# Altium schematic sheet Rev_C_Power.SchDoc
size A3
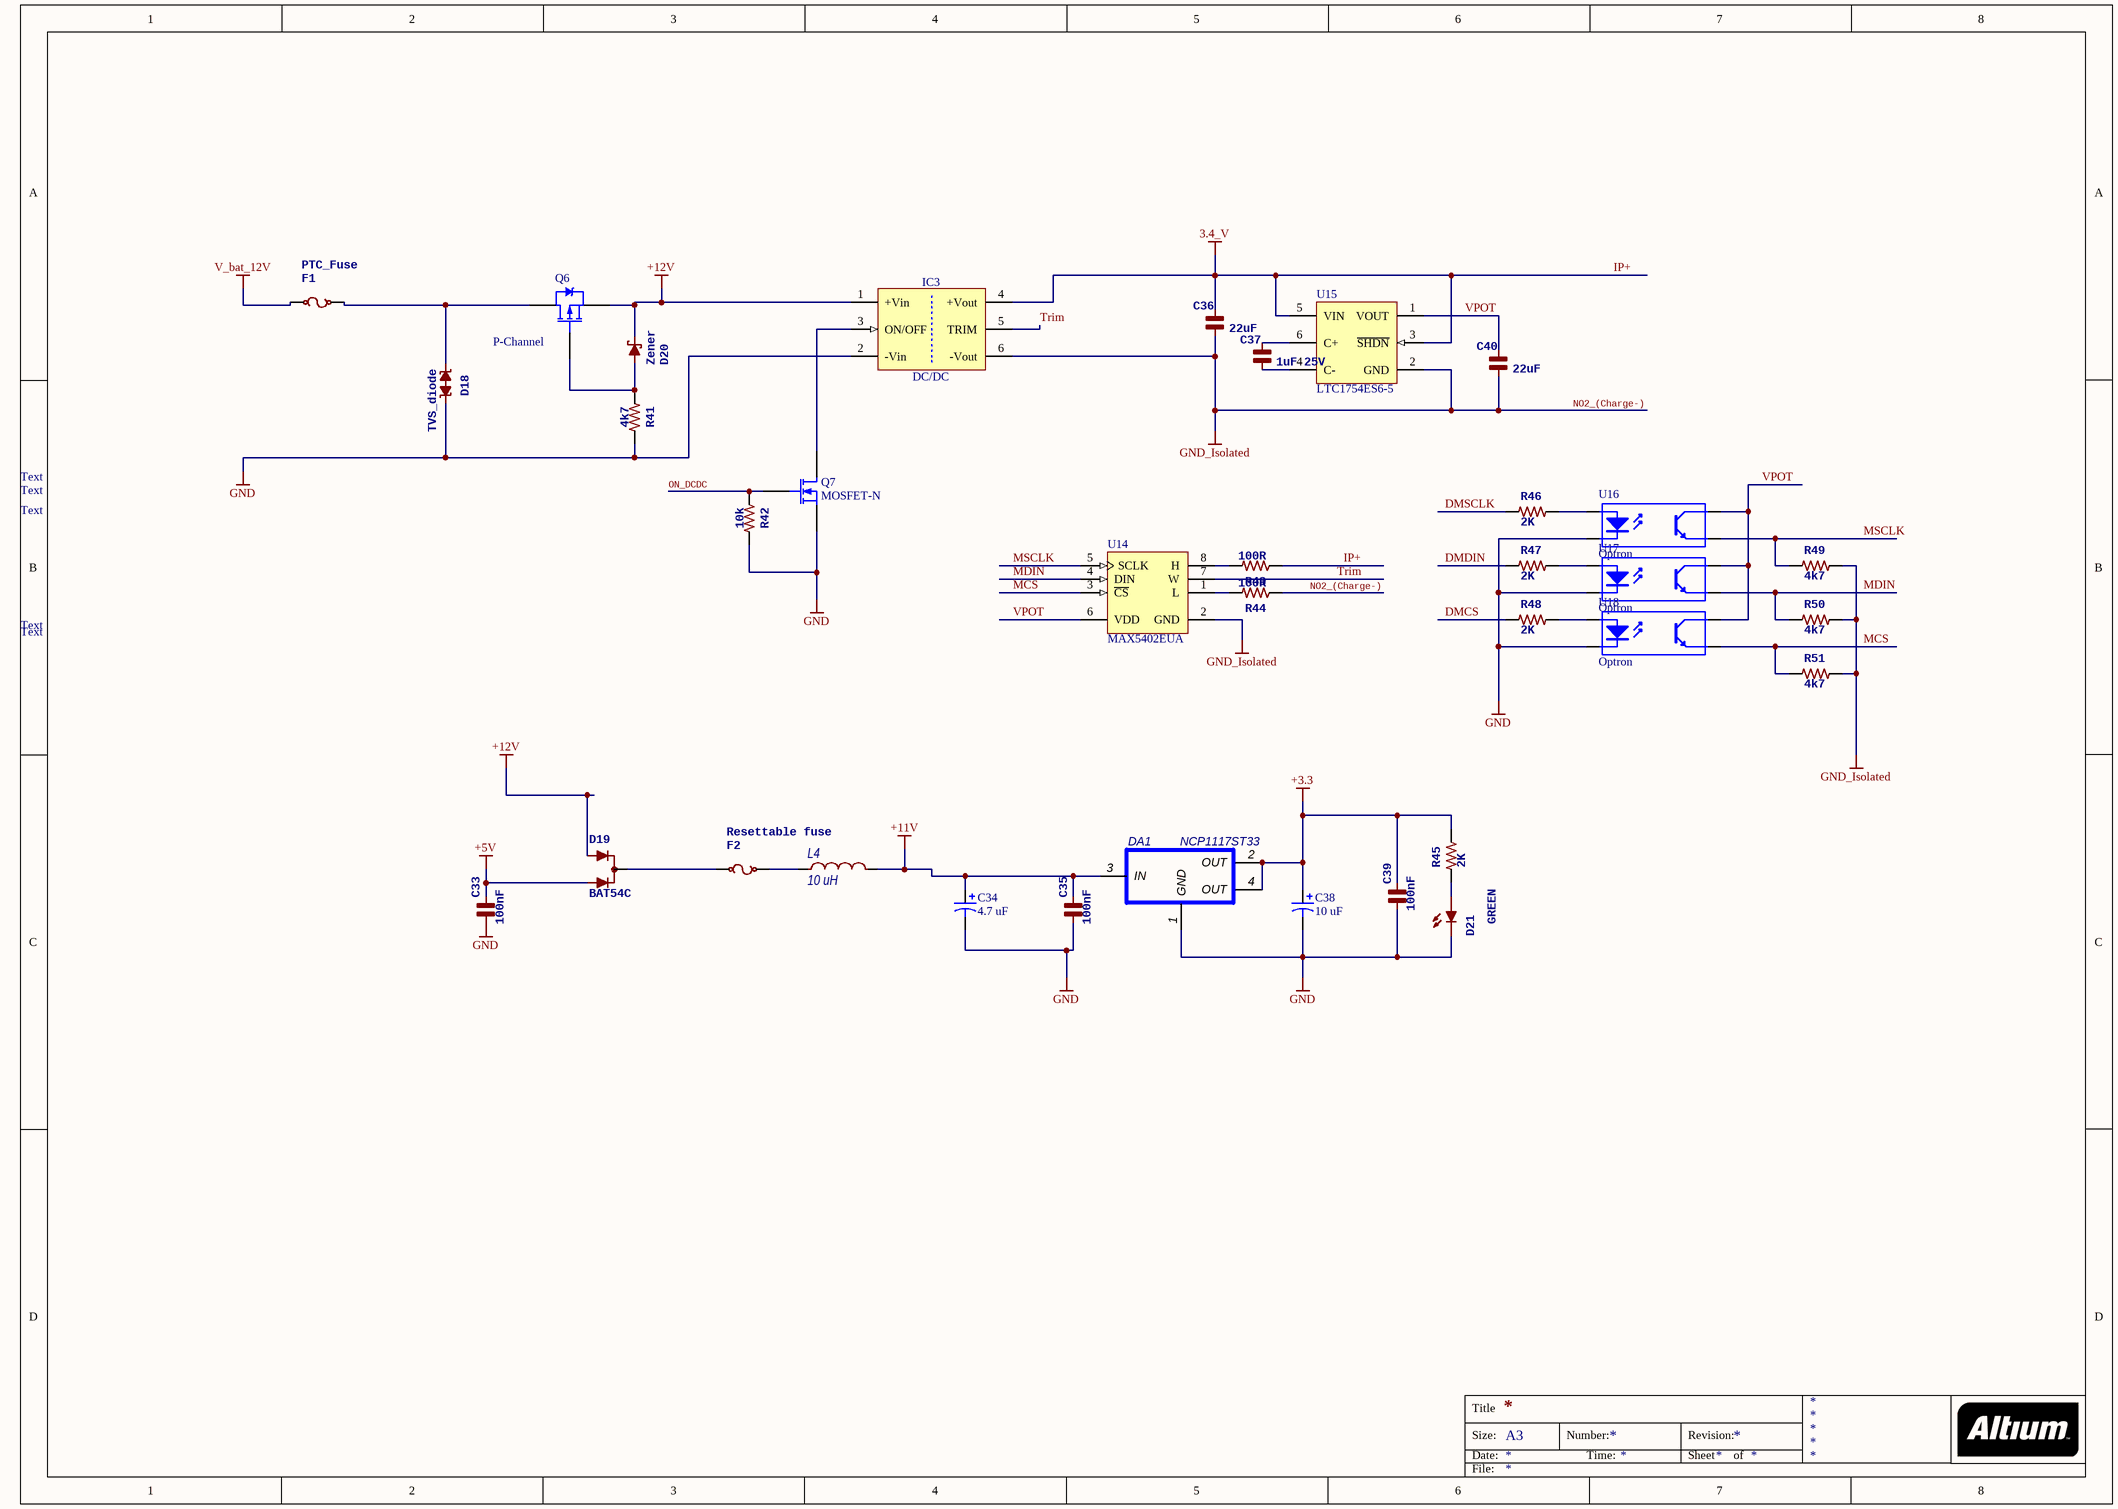
[diagram p0: Rev_C_Power.SchDoc]

## Parts
C33  100nF  [C0603]
C34  4.7 uF  [SMD D]
C35  100nF  [C0603]
C36  22uF  [C0603]
C37  1uF 25V  [C0603]
C38  10 uF  [SMD A]
C39  100nF  [C0603]
C40  22uF  [C0603]
D18  TVS_diode  [SMB_BIDIR]
D19  BAT54C  [SOT23]
D20  Zener  [SOD523]
D21  GREEN  [CHIP-LED0603]
DA1  NCP1117ST33  [SOT223]
F1  PTC_Fuse  [RUEF250]
F2  Resettable fuse  [R1206]
IC3  DC/DC  [DCDC_1x1]
L4  10 uH  [C0603]
Q6  P-Channel  [SO-8 - IRF FET]
Q7  MOSFET-N  [SOT23-3N]
R41  4k7  [R0603]
R42  10k  [R0603]
R43  100R  [R0603]
R44  100R  [R0603]
R45  2K  [R0603]
R46  2K  [R0603]
R47  2K  [R0603]
R48  2K  [R0603]
R49  4k7  [R0603]
R50  4k7  [R0603]
R51  4k7  [R0603]
U14  MAX5402EUA  [MAXM-U8-1_N]
U15  LTC1754ES6-5  [LT-S6-6-SOT-23_N]
U16  Optron  [LTV-816S]
U17  Optron  [LTV-816S]
U18  Optron  [LTV-816S]

## Nets
+3.3: C38.1 C39.2 DA1.2(OUT) DA1.4(OUT) R45.2
+5V: C33.2 D19.2(A2)
+11V: C34.1 C35.2 DA1.3(IN) L4.2
+12V: D19.1(A1) D20.C IC3.1(+Vin) Q6.1(S)
GND: C33.1 C34.2 C35.1 C38.2 C39.1 D18.2 D21.C DA1.1(GND) IC3.2(-Vin) Q7.2(S) R41.2 R42.2 U16.2(K) U17.2(K) U18.2(K)
IP+: C36.2 IC3.4(+Vout) R43.1 U15.3(~{SHDN}) U15.5(VIN)  [also labelled 3.4_V]
NO2_(Charge-): C36.1 C40.1 IC3.6(-Vout) R44.1 R49.2 R50.2 R51.2 U14.2(GND) U15.2(GND)  [also labelled GND_Isolated]
V_bat_12V: F1.1
DMCS: R48.1
DMDIN: R47.1
DMSCLK: R46.1
MCS: R51.1 U14.3(~{CS}) U18.3(E)
MDIN: R50.1 U14.4(DIN) U17.3(E)
MSCLK: R49.1 U14.5(SCLK) U16.3(E)
ON_DCDC: Q7.1(G) R42.1
Trim: IC3.5(TRIM) U14.7(W)
VPOT: C40.2 U14.6(VDD) U15.1(VOUT) U16.4(C) U17.4(C) U18.4(C)
NetC37_1: C37.1 U15.4(C-)
NetC37_2: C37.2 U15.6(C+)
NetD18_1: D18.1 F1.2 Q6.3(D)
NetD19_3: D19.3(C) F2.1
NetD20_A: D20.A Q6.2(G) R41.1
NetD21_A: D21.A R45.1
NetF2_2: F2.2 L4.1
NetIC3_3: IC3.3(ON/OFF) Q7.3(D)
NetR43_2: R43.2 U14.8(H)
NetR44_2: R44.2 U14.1(L)
NetR46_2: R46.2 U16.1(A)
NetR47_2: R47.2 U17.1(A)
NetR48_2: R48.2 U18.1(A)

## Notes on the sheet
- Text
- Title
- Size:
- Date:
- A3
- Number:
- Time:
- Revision:
- Sheet
- of
- File:

## Library data of the parts
C33 C35 C39 = C_0603: GRM188R71E104KA01J; MPN: GRM188F51E104ZA01D; MF: MURATA; OC_FARNELL: 1828902; Value: 100nF
C34 = Cap Pol2: 293D475X9050D2WE3; Published: 8-Jun-2000; LatestRevisionDate: 17-Jul-2002; LatestRevisionNote: Re-released for DXP Platform.; PackageReference: POLAR0.8; Publisher: Altium Limited; PackageDescription: Polarized Capacitor; 2 Leads; Value: 4.7 uF
C36 C40 = C_0603: ZRB18AR61A226ME01L; MF: MURATA; Value: 22uF
C37 = C_0603: 885012106022; MF: MURATA; Value: 1uF 25V
C38 = Cap Pol2: THJA106K010AJN; Published: 8-Jun-2000; LatestRevisionDate: 17-Jul-2002; LatestRevisionNote: Re-released for DXP Platform.; PackageReference: POLAR0.8; Publisher: Altium Limited; PackageDescription: Polarized Capacitor; 2 Leads; Value: 10 uF
D18 = DIODE-TVS-SMAJ_1: SMAJ17CA
D19 = BAT54C: BAT54C-G; OC_FARNELL: unknown
D20 = SCHOTTKY-DIODESMA_2: BZT52C10T-7
D21 = LEDCHIP-LED0603_2: 150060VS75000; Manufacturer Part Number: 150060RS75000; BLUE: 150060BS75000; YELLOW: 150060YS75000; GREEN: 150060VS75000; RED: 150060RS75000; Value: GREEN
DA1 = NCP1117ST33: NCP1117LPST33T3G; Title: stabilizer; Value: *
F1 = RUEF250: Value: 9A
F2 = 3216CP-3A_1: 0ZCJ0050AF2E; Value: 500mA
IC3 = DCDC_TDK_30_Single Output: PDQ30-Q24-S3-D
L4 = L2: KLZ1608MHR100WTD25; group: Индуктивность; value: 10 uH; sheet: ="value"+' '+"tollerance"+' '+"package"; list: ="value"+' '+"tollerance"+' '+"package"+' '+"document"
Q6 = PMOS-2: FDS6681Z; Note: Pin 4 not drawn and electrically connected to Pin 2.; Published: 8-Jun-2000; LatestRevisionDate: 17-Jul-2002; LatestRevisionNote: Re-released for DXP Platform.; DatasheetVersion: PD-9.390D; PackageVersion: Feb-1997; PackageReference: TO-220AB; Publisher: Altium Limited; PackageDescription: TO, Thru-Hole, Vertical, Heatsink Mounted; 3 In-Line Leads; Pitch 2.54 mm; ComponentLink1Description: Manufacturer Link; ComponentLink1URL: http://www.irf.com/
Q7 = MOSFET-N: NTR4170NT1G; Published: 8-Jun-2000; LatestRevisionDate: 17-Jul-2002; LatestRevisionNote: Re-released for DXP Platform.; PackageVersion: 1995/1996; PackageReference: E3; Publisher: Altium Limited; PackageDescription: TO, Flat Index; 3 In-Line, Axial Leads; Body Dia. 4.6mm; Lead Dia. 0.5 mm (max)
R41 R49-R51 = R_0603_18: RC0603FR-074K7L; OC_FARNELL: unknown; Manufacturer Part Number: RC0603FR-074K7L; Value: 4k7
R42 = R_0603_18: RC0603FR-0710KL; OC_FARNELL: unknown; Manufacturer Part Number: RC0603FR-0710KL; Value: 10k
R43 R44 = R_0603_18: RC0603FR-07100RL; OC_FARNELL: unknown; Manufacturer Part Number: RC0603FR-07100RL; Value: 100R
R45-R48 = R_0603_18: RC0603FR-072KL; OC_FARNELL: unknown; Manufacturer Part Number: RC0603FR-072KL; Value: 2K
U14 = MAX5402EUA: MAX5402EUA+; Control Interface: 3-Wire Serial; DatasheetVersion: Rev. 0; PackageVersion: Rev. L, 08/2009; PackageReference: U8-1; PackageDescription: 8-Pin Micro-MAX, Thin Shrink Small-Outline (U8-1), Body 3 x 3 mm, Pitch 0.65mm; Supplier 1: Digi-Key; Supplier Part Number 1: MAX5402EUA-ND; Supplier 2: Mouser; Supplier Part Number 2: N/A; Mounting Technology: Surface Mount; Code_JEDEC: MO-187; PartNumber: MAX5402EUA; ComponentLink1Description: Manufacturer URL; ComponentLink1URL: http://www.maximintegrated.com/; ComponentLink2Description: Datasheet; ComponentLink2URL: http://datasheets.maximintegrated.com/en/ds/MAX5402.pdf; ComponentLink3Description: Package Specification; ComponentLink3URL: http://pdfserv.maximintegrated.com/package_dwgs/21-0036.PDF
U15 = LTC1754ES6-5: Manufacturer: Linear Technology; Frequency(kHz): 700; Ishutdown(uA): 0.01; Isupply(mA): 0.013; Max Iout(mA): 40; Vin Max(V): 5.5; Vin Min(V): 2.7; Voutput: 5V; PackageVersion: Aug-07; PackageReference: S6-6; PackageDescription: 6-Pin Plastic SOT-23, Body 1.625 x 2.9 mm, Pitch 0.95 mm; RoHS: FALSE; Mounting Technology: Surface Mount; PartNumber: LTC1754ES6-5; ComponentLink1Description: Manufacturer URL; ComponentLink1URL: http://www.linear.com/; ComponentLink2Description: Datasheet; ComponentLink2URL: http://cds.linear.com/docs/en/datasheet/175435f.pdf; ComponentLink3Description: Package Specification; ComponentLink3URL: http://cds.linear.com/docs/en/datasheet/175435f.pdf
U16-U18 = Optoisolator1: LTV-816S; Published: 24-Mar-1999; LatestRevisionDate: 04-Mar-2005; LatestRevisionNote: Sch pins 3 & 4 Swapped.; DatasheetVersion: Nov-2003; PackageReference: DIP-4; Publisher: Altium Limited